# Altium schematic sheet Motor Interface - Pre-Charge HV.SchDoc: Motor Interface - PreCharge HV
size B; Organization: Midnight Sun Solar Rayce Car Team; Address1: University of Waterloo; Address2: 200 University Ave W; Address3: Waterloo, ON, Canada; Address4: N2L 3E9; DocumentNumber: 5; SheetNumber: 5; SheetTotal: 6; Website: www.uwmidsun.com; ProjectName: ProjectName
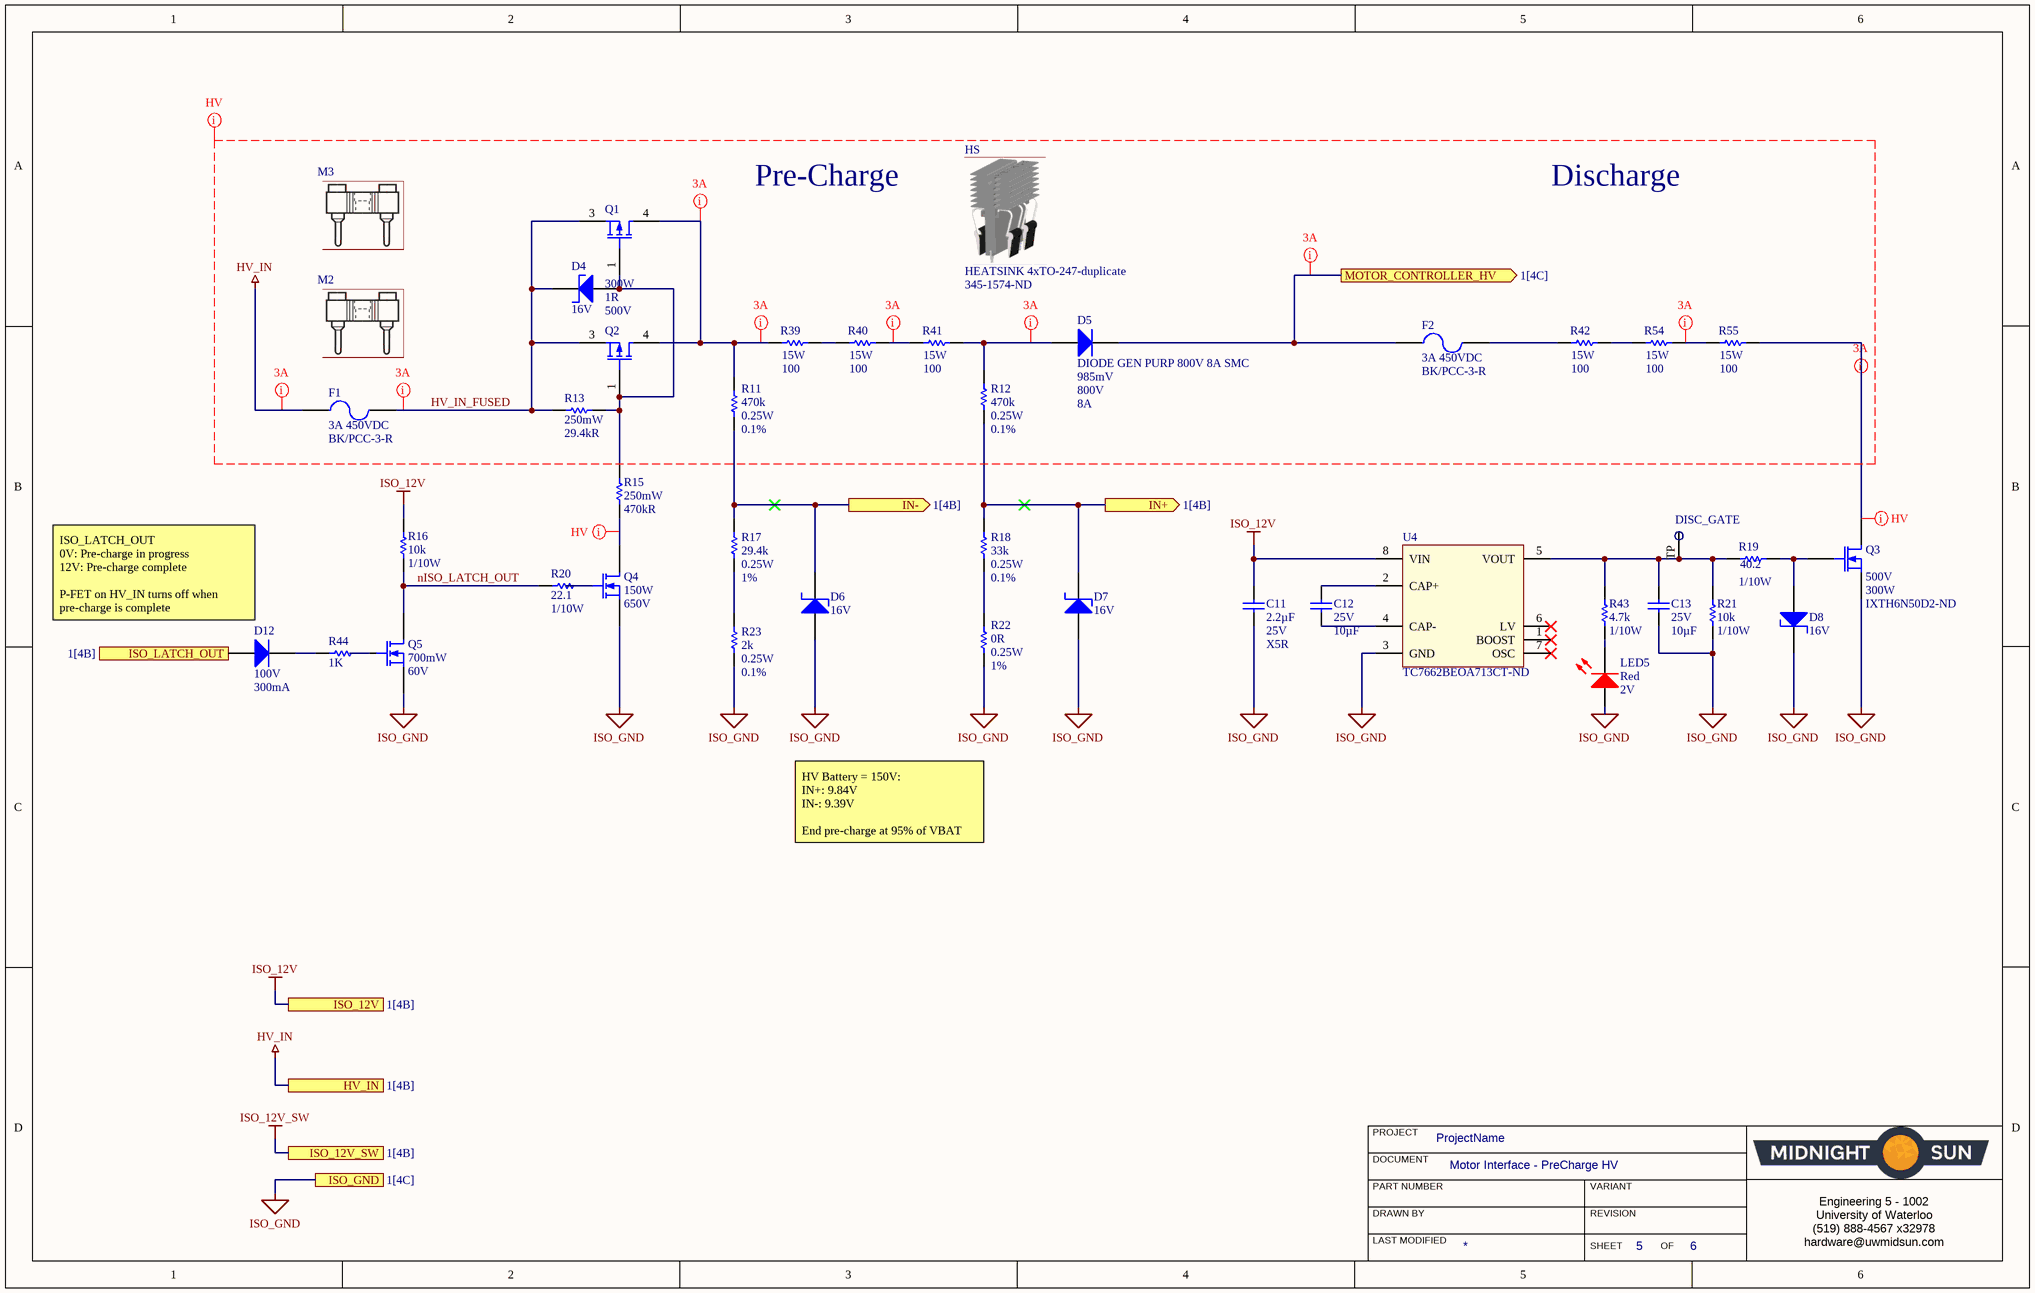
[diagram p0: Motor Interface - Pre-Charge HV.SchDoc]

## Parts
C11  Capacitance: 2.2µF  Voltage: 25V  Temperature Coefficient: X5R  [CAP, 0603]  (hidden comment: CAP CER 2.2UF 25V 10% X5R 0603)
C12  Voltage - Rated: 25V  Capacitance: 10µF  [CAP, 0805]  (hidden comment: CAP CER 10uF 25V 10% X5R 0805)
C13  Voltage - Rated: 25V  Capacitance: 10µF  [CAP, 0805]  (hidden comment: CAP CER 10uF 25V 10% X5R 0805)
D4  Voltage - Zener (Nom): 16V  [DO-214AA Diode]  (hidden comment: DIODE ZENER 16V 5W DO-214AA (SMB))
D5  DIODE GEN PURP 800V 8A SMC  Forward Voltage: 985mV  Max Reverse Voltage (DC): 800V  Forward Current: 8A  [DIODE, SMC]
D6  Voltage - Zener (Nom): 16V  [DO-214AA Diode]  (hidden comment: DIODE ZENER 16V 5W DO-214AA (SMB))
D7  Voltage - Zener (Nom): 16V  [DO-214AA Diode]  (hidden comment: DIODE ZENER 16V 5W DO-214AA (SMB))
D8  Voltage - Zener (Nom): 16V  [DO-214AA Diode]  (hidden comment: DIODE ZENER 16V 5W DO-214AA (SMB))
D12  Max Repetitive Reverse Voltage (Vrrm): 100V  Forward Current: 300mA  [DIODE GEN PURP 100V 300MA SOD123]  (hidden comment: DIODE GEN PURP 100V 300MA SOD123)
DISC_GATE  Test Point  [Test Point]  (value not drawn)  (no BOM)
F1  3A 450VDC  Manufacturer Part Number: BK/PCC-3-R  [FUSE 5A 400VDC RADIAL]
F2  3A 450VDC  Manufacturer Part Number: BK/PCC-3-R  [FUSE 5A 400VDC RADIAL]
HS  HEATSINK 4xTO-247-duplicate  Supplier Part Number 1: 345-1574-ND  [HEATSINK 4x TO-247 - duplicate]
LED5  Color: Red  Voltage - Forward (Vf) (Typ): 2V  [LED_0603]  (hidden comment: LED RED CLEAR 2V 0603)
M2  FUSE HOLDER PC-TRON RADIAL  (value not drawn)  (mechanical)
M3  FUSE HOLDER PC-TRON RADIAL  (value not drawn)  (mechanical)
Q1  Max Power Dissipation: 300W  Rds On Max: 1R  Drain to Source Voltage (Vdss): 500V  [P-CH MOSFET 500V 10A 300W TO-263]  (hidden comment: IXTA10P50P)
Q2  IXTA10P50P  [P-CH MOSFET 500V 10A 300W TO-263]  (value not drawn)
Q3  Drain to Source Voltage (Vdss): 500V  Max Power Dissipation: 300W  Supplier Part Number 1: IXTH6N50D2-ND  [N-CH Depletion Mode TO-247-3]  (hidden comment: MOSFET DEPLETION N-CH 500V 6A TO247)
Q4  Max Power Dissipation: 150W  Drain to Source Voltage (Vdss): 650V  [P-CH MOSFET 500V 10A 300W TO-263]  (hidden comment: MOSFET N-CH 650V 8A X2 TO-263)
Q5  Max Power Dissipation: 700mW  Drain to Source Voltage (Vdss): 60V  [SOT23]  (hidden comment: MOSFET N-CH 60V 310MA SOT23)
R11  Tolerance: 0.1%  Max Power Dissipation: 0.25W  Resistance: 470k  [RES 1206]  (hidden comment: RESISTOR)
R12  Tolerance: 0.1%  Max Power Dissipation: 0.25W  Resistance: 470k  [RES 1206]  (hidden comment: RESISTOR)
R13  Max Power Dissipation: 250mW  Resistance: 29.4kR  [RES 1206]  (hidden comment: Resistor)
R15  Max Power Dissipation: 250mW  Resistance: 470kR  [RES 1206]  (hidden comment: RESISTOR)
R16  Resistance: 10k  Power: 1/10W  [RES, 0603]  (hidden comment: RES 10K OHM 1% 1/10W 0603)
R17  Tolerance: 1%  Max Power Dissipation: 0.25W  Resistance: 29.4k  [RES 1206]  (hidden comment: Resistor)
R18  Tolerance: 0.1%  Resistance: 33k  Max Power Dissipation: 0.25W  [RES 1206]  (hidden comment: Resistor)
R19  Resistance: 40.2  Power: 1/10W  [RES, 0603]  (hidden comment: RES 40.2 OHM 0.5% 1/10W 0603)
R20  Resistance: 22.1  Power: 1/10W  [RES, 0603]  (hidden comment: RES 22.1 OHM 1% 1/10W 0603)
R21  Resistance: 10k  Power: 1/10W  [RES, 0603]  (hidden comment: RES 10K OHM 1% 1/10W 0603)
R22  Tolerance: 1%  Power Rating: 0.25W  Resistance: 0R  [RES 1206]  (hidden comment: RES SMD 0 OHM JUMPER 1/4W 1206)
R23  Tolerance: 0.1%  Max Power Dissipation: 0.25W  Resistance: 2k  [RES 1206]  (hidden comment: RES SMD 2K OHM 0.1% 1/4W 1206)
R39  RES 100 OHM 15W 1% TO126  [RES TO-126-2]  (value not drawn)
R40  RES 100 OHM 15W 1% TO126  [RES TO-126-2]  (value not drawn)
R41  RES 100 OHM 15W 1% TO126  [RES TO-126-2]  (value not drawn)
R42  RES 100 OHM 15W 1% TO126  [RES TO-126-2]  (value not drawn)
R43  Resistance (Ohms): 4.7k  Power (Watts): 1/10W  [RES, 0603]  (hidden comment: RES 4.7K OHM 1% 1/10W 0603)
R44  1K  [RES, 0603]
R54  RES 100 OHM 15W 1% TO126  [RES TO-126-2]  (value not drawn)
R55  RES 100 OHM 15W 1% TO126  [RES TO-126-2]  (value not drawn)
U4  Supplier Part Number 1: TC7662BEOA713CT-ND  [SOIC8]  (hidden comment: IC REG SWTCHD CAP INV 20MA 8SOIC)

## Ports
HV_IN (see 1[4B]), IN+ (out, see 1[4B]), IN- (out, see 1[4B]), ISO_12V (see 1[4B]), ISO_12V_SW (see 1[4B]), ISO_GND (see 1[4C]), ISO_LATCH_OUT (in, see 1[4B]), MOTOR_CONTROLLER_HV (out, see 1[4C])

## Nets
HV_IN: F1.1 ; port HV_IN
ISO_12V: C11.2 R16.1 U4.8(VIN) ; port ISO_12V
ISO_12V_SW: port ISO_12V_SW
ISO_GND: C11.1 C13.2 D6.1(A) D7.1(A) D8.2(K) LED5.1(A) Q3.3(S) Q4.3(S) Q5.2(S) R21.2 R22.2 R23.2 U4.3(GND) ; port ISO_GND
HV_IN_FUSED: D4.2(K) F1.2 Q1.3(S) Q2.3(S) R13.1
IN+: D7.2(K) R12.2 R18.1 ; port IN+
IN-: D6.2(K) R11.2 R17.1 ; port IN-
ISO_LATCH_OUT: D12.1(A) ; port ISO_LATCH_OUT
MOTOR_CONTROLLER_HV: D5.1(K) F2.1 ; port MOTOR_CONTROLLER_HV
nISO_LATCH_OUT: Q5.1(D) R16.2 R20.1
NetC12_1: C12.1 U4.2(CAP+)
NetC12_2: C12.2 U4.4(CAP-)
NetC13_1: C13.1 DISC_GATE.TP R19.1 R21.1 R43.1 U4.5(VOUT)
NetD4_1: D4.1(A) Q1.1(G) Q2.1(G) R13.2 R15.1
NetD5_2: D5.2(A) R12.1 R41.2
NetD8_1: D8.1(A) Q3.1(G) R19.2
NetD12_2: D12.2(K) R44.1
NetF2_2: F2.2 R42.1
NetLED5_2: LED5.2(K) R43.2
NetQ1_4: Q1.4(D) Q2.4(D) R11.1 R39.1
NetQ3_2: Q3.2(D) R55.2
NetQ4_1: Q4.1(G) R20.2
NetQ4_4: Q4.4(D) R15.2
NetQ5_3: Q5.3(G) R44.2
NetR17_2: R17.2 R23.1
NetR18_2: R18.2 R22.1
NetR39_2: R39.2 R40.1
NetR40_2: R40.2 R41.1
NetR42_2: R42.2 R54.1
NetR54_2: R54.2 R55.1

Not connected (* = marked no-connect by the designer): U4 1(BOOST)* 6(LV)* 7(OSC)*

## Layout directives
net class HV: HV_IN, HV_IN_FUSED, NetQ3_2, NetQ4_4
mark named 3A: HV_IN, HV_IN_FUSED, MOTOR_CONTROLLER_HV, NetD5_2, NetQ1_4, NetQ3_2, NetR40_2, NetR54_2

## Notes on the sheet
- (near HS) Pre-Charge
- Discharge
- (near D12) ISO_LATCH_OUT
  0V: Pre-charge in progress
  12V: Pre-charge complete
  P-FET on HV_IN turns off when pre-charge is complete
- HV Battery = 150V:
  IN+: 9.84V
  IN-: 9.39V
  End pre-charge at 95% of VBAT
- PROJECT
- DOCUMENT
- DRAWN BY
- LAST MODIFIED
- PART NUMBER
- REVISION
- SHEET
- VARIANT
- OF
- Engineering 5 - 1002
  University of Waterloo
  (519) 888-4567 x32978
  hardware@uwmidsun.com
- (in symbol RES 100 OHM 15W 1% TO126) 100

## Library data of the parts
C11 = CAP CER 2.2UF 25V 10% X5R 0603: 2.2µF ±10% 25V Ceramic Capacitor X5R 0603 (1608 Metric); Manufacturer 1: Murata Electronics North America; Manufacturer Part Number 1: GRM188R61E225KA12D; Supplier 1: Digi-Key; Supplier Part Number 1: 490-10731-1-ND; Packaging: Cut Tape (CT); Part Status: Active; Operating Temperature: -55°C ~ 85°C; Ratings: -; Mounting Type: Surface Mount, MLCC; Package / Case: 0603 (1608 Metric); Size / Dimension: 0.063" L x 0.031" W (1.60mm x 0.80mm); Height - Seated (Max): -; Thickness (Max): 0.035" (0.90mm); Lead Spacing: -; Lead Style: -; ComponentLink1URL: http://www.murata.com/~/media/webrenewal/support/library/catalog/products/capacitor/mlcc/c02e.ashx; ComponentLink1Description: http://www.murata.com/~/media/webrenewal/support/library/catalog/products/capacitor/mlcc/c02e.ashx; Tolerance: ±10%
C12 C13 = CAP CER 10uF 25V 10% X5R 0805: 10µF ±10% 25V Ceramic Capacitor X5R 0805 (2012 Metric); Manufacturer: Murata Electronics North America; Manufacturer Part Number: GRM21BR61E106KA73L; Supplier 1: Digi-Key; RoHS: RoHS Compliant; Category: Capacitors; Stock 1: 1695157; Packaging: Cut Tape (CT); Part Status: Active; Tolerance: ±10%; Temperature Coefficient: X5R; Operating Temperature: -55°C ~ 85°C; Features: -; Ratings: -; Applications: General Purpose; Mounting Type: Surface Mount, MLCC; Package / Case: 0805 (2012 Metric); Size / Dimension: 0.079" L x 0.049" W (2.00mm x 1.25mm); Height - Seated (Max): -; Thickness (Max): 0.053" (1.35mm); Lead Spacing: -; Lead Style: -; ComponentLink1URL: http://search.murata.co.jp/Ceramy/image/img/A01X/G101/ENG/GRM21BR61E106KA73-01.pdf; ComponentLink1Description: http://search.murata.co.jp/Ceramy/image/img/A01X/G101/ENG/GRM21BR61E106KA73-01.pdf; Supplier Part Number 1: 490-5523-1-ND; Pricing 1: 1=0.3, 10=0.214, 100=0.1008, 500=0.07068, 1000=0.05851 (CAD)
D4 D6-D8 = DIODE ZENER 16V 5W DO-214AA (SMB): Zener Diode 16V 5W ±5% Surface Mount DO-214AA (SMB); Manufacture: Micro Commercial Co; Manufacture Part Number: SMBJ5353B-TP; Impedence (Max): 2.5 Ohm; Voltage - Forward: 1.2V @ 1A; Power (Max): 5W; Supplier 1: Digi-Key; Supplier Part Number 1: SMBJ5353B-TPMSCT-ND
D5 = DIODE GEN PURP 800V 8A SMC: Manufacturer: Diodes; Manufacturer Part Number: S8KC-13; Peak Reverse Current: 10uA; Max Surge Current: 200A; Element Configuration: Single; Supplier 1: Digi-Key; Stock 1: 38298; Pricing 1: 1=0.68, 10=0.598, 100=0.4586, 500=0.36256, 1000=0.29005 (USD); Mount: Surface Mount; Case/Package: SMC; Number of Pins: 2; Weight: 0.007408oz; Contact Plating: Tin,Matte; Min Operating Temperature: -65°C; Max Operating Temperature: 150°C; Packaging: Tape and Reel; Package Quantity: 3000; Reverse Voltage (DC): 800V; Average Rectified Current: 8A; Max Repetitive Reverse Voltage (Vrrm): 800V; Peak Non-Repetitive Surge Current: 200A; Max Forward Surge Current (Ifsm): 200A; Length: 7.11mm; Height: 2.42mm; Width: 6.22mm; Radiation Hardening: No; Lead Free: Lead Free; ComponentLink1URL: https://datasheet.ciiva.com/15144/getdatasheetpartid-61102-15144323.pdf; ComponentLink1Description: https://datasheet.ciiva.com/15144/getdatasheetpartid-61102-15144323.pdf; ComponentLink2URL: https://datasheet.ciiva.com/16388/ds31117-16388346.pdf; ComponentLink2Description: https://datasheet.ciiva.com/16388/ds31117-16388346.pdf; ComponentLink3URL: https://datasheet.ciiva.com/914/ds31117-914779.pdf; ComponentLink3Description: https://datasheet.ciiva.com/914/ds31117-914779.pdf; ComponentLink4URL: https://datasheet.ciiva.com/4453/ds31117-63855-4453947.pdf; ComponentLink4Description: https://datasheet.ciiva.com/4453/ds31117-63855-4453947.pdf; Supplier Part Number 1: S8KCDICT-ND
D12 = DIODE GEN PURP 100V 300MA SOD123: Diode Standard 100V 300mA (DC) Surface Mount SOD-123; Manufacturer: Diodes Zetex; Manufacturer Part Number: 1N4148WQ-7-F; Max Surge Current: 2A; Forward Voltage: 1.25V; Element Configuration: Single; Recovery Time: 4ns; Peak Reverse Current: 50uA; Max Power Dissipation: 400mW; Supplier 1: Digi-Key; Stock 1: 229; Pricing 1: 1=0.22, 10=0.196, 100=0.107, 500=0.0658, 1000=0.0449 (USD); Mount: Surface Mount; Case/Package: SOD-123-2; Number of Pins: 2; Weight: 0.000353oz; Contact Plating: Tin,Matte; Min Operating Temperature: -65°C; Max Operating Temperature: 150°C; Packaging: Tape and Reel; Peak Non-Repetitive Surge Current: 2A; Package Quantity: 3000; Reverse Recovery Time: 4ns; Lead Free: Lead Free; ComponentLink1URL: http://components.arrow.com/part/dataview/0323_07206809; ComponentLink1Description: http://components.arrow.com/part/dataview/0323_07206809; ComponentLink2URL: http://www.diodes.com/datasheets/ds30086.pdf; ComponentLink2Description: http://www.diodes.com/datasheets/ds30086.pdf; ComponentLink3URL: http://www.mouser.com/ds/2/115/ds30086-318161.pdf; ComponentLink3Description: http://www.mouser.com/ds/2/115/ds30086-318161.pdf; Supplier Part Number 1: 1N4148WQ-7-FDICT-ND
F1 F2 = FUSE 3A 250VAC/450VDC RADIAL: FUSE BOARD MNT 3A 250VAC/450VDC; Manufacturer: Eaton; Approvals: CSA,UL; Fuse Type: Board Mount (Cartridge Style Excluded); Voltage Rating: 250V; Voltage Rating (DC): 450V; Supplier 1: Digi-Key; ComponentLink1Description: http://www.cooperindustries.com/content/dam/public/bussmann/Electronics/Resources/product-datasheets/Bus_Elx_DS_2034_PC_Tron_Series.pdf; ComponentLink1URL: http://www.cooperindustries.com/content/dam/public/bussmann/Electronics/Resources/product-datasheets/Bus_Elx_DS_2034_PC_Tron_Series.pdf; Supplier Part Number 1: 283-2768-ND; Case/Package: Radial; Contact Plating: Tin; Current Rating: 3A; Depth: 2.41mm; Height: 0.17inch; Housing Material: Plastic; Length: 0.3inch; Mount: Through Hole; Number of Pins: 2; Packaging: Bulk; Voltage Rating (AC): 250V; Width: 0.095inch; Supplier Packaging 1: Bulk; RoHS: Yes; Stock 1: 4171
HS = HEATSINK 4xTO-247-duplicate: n Heat Sink TO-220, TO-247, TO-264 Aluminum Board Level, Vertical; Manufacturer: Wakefield; Manufacturer Part Number: OMNI-UNI-30-50-D; Supplier 1: Digi-Key; Stock 1: 465; Pricing 1: 1=4.09, 10=3.98, 25=3.8724, 50=3.6572, 100=3.4421, 250=3.22696, 500=3.11938, 1000=2.79669 (USD)
LED5 = LED RED CLEAR 2V 0603: Red 631nm LED Indication - Discrete 2V 0603 (1608 Metric); Manufacturer: Wurth Electronics Inc.; Manufacturer Part Number: 150060RS75000; Lens Color: Colorless; Millicandela Rating: 250mcd; Lens Style/Size: Rectangle with Flat Top, 1.10mm x 0.70mm; Current - Test: 20mA; Viewing Angle: 140°; Wavelength - Dominant: 625nm; Wavelength - Peak: 630nm; Supplier 1: Digi-Key; RoHS: RoHS Compliant; Category: Optoelectronics; Stock 1: 35521; Pricing 1: 1=0.21, 100=0.1617, 500=0.13964 (CAD); Packaging: Cut Tape (CT); Part Status: Active; Lens Transparency: Clear; Mounting Type: Surface Mount; Features: -; Package / Case: 0603 (1608 Metric); Supplier Device Package: 0603; Size / Dimension: 1.60mm L x 0.80mm W; Height (Max): 0.80mm; ComponentLink1URL: http://katalog.we-online.de/led/datasheet/150060RS75000.pdf; ComponentLink1Description: http://katalog.we-online.de/led/datasheet/150060RS75000.pdf; Supplier Part Number 1: 732-4978-1-ND
M2 M3 = FUSE HOLDER PC-TRON RADIAL: Fuse Holder 1 Circuit Radial PCB; Manufacturer: Eaton; Manufacturer Part Number: BK/PCS; Number of Circuits: 1; Case/Package: Radial; Mount: PCB; Orientation: Vertical; Pricing 1: 1 = 1.54000, 5 = 1.49400, 10 = 1.39800, 50 = 1.15680, 100 = 0.96400, 250 = 0.93992, 500 = 0.79530, 1000 = 0.69890, 5000 = 0.62660 (USD); RoHS: Yes; Stock 1: 7906; Supplier 1: Digi-Key; Supplier Part Number 1: 283-2356-ND; Termination: PC Pin
Q1 = MOSFET P-CH 500V 10A 300W TO-263: P-Channel 500V 10A (Tc) 300W (Tc) Surface Mount TO-263 (IXTA); Manufacturer: IXYS; Input Capacitance: 2.84nF; Rise Time: 28ns; Fall Time: 44ns; Turn-Off Delay Time: 52ns; Number of Elements: 1; Element Configuration: Single; Drain to Source Breakdown Voltage: -500V; Gate to Source Voltage (Vgs): 20V; Supplier 1: Digi-Key; Manufacturer Part Number: IXTA10P50P; Stock 1: 2142; Pricing 1: 1=5.96, 10=5.319, 100=4.3614, 500=3.53166, 1000=2.9785 (USD); Mount: Surface Mount; Case/Package: TO-263; Min Operating Temperature: -55°C; Max Operating Temperature: 150°C; Package Quantity: 50; Packaging: Rail/Tube; Continuous Drain Current (ID): 10A; Drain to Source Resistance: 1R; Power Dissipation: 300W; On-State Resistance: 1R; Radiation Hardening: No; Lead Free: Lead Free; ComponentLink1URL: https://datasheet.ciiva.com/15203/getdatasheetpartid-371166-15203275.pdf; ComponentLink1Description: https://datasheet.ciiva.com/15203/getdatasheetpartid-371166-15203275.pdf; Supplier Part Number 1: IXTA10P50P-ND
Q2 = MOSFET P-CH 500V 10A 300W TO-263: P-Channel 500V 10A (Tc) 300W (Tc) Surface Mount TO-263 (IXTA); Manufacturer: IXYS; Input Capacitance: 2.84nF; Rise Time: 28ns; Fall Time: 44ns; Drain to Source Resistance: 1R; Turn-Off Delay Time: 52ns; Number of Elements: 1; Element Configuration: Single; Drain to Source Breakdown Voltage: -500V; Gate to Source Voltage (Vgs): 20V; Supplier 1: Digi-Key; Manufacturer Part Number: IXTA10P50P; Stock 1: 2142; Pricing 1: 1=5.96, 10=5.319, 100=4.3614, 500=3.53166, 1000=2.9785 (USD); Mount: Surface Mount; Case/Package: TO-263; Min Operating Temperature: -55°C; Max Operating Temperature: 150°C; Package Quantity: 50; Packaging: Rail/Tube; Continuous Drain Current (ID): 10A; Power Dissipation: 300W; On-State Resistance: 1R; Radiation Hardening: No; Lead Free: Lead Free; ComponentLink1URL: https://datasheet.ciiva.com/15203/getdatasheetpartid-371166-15203275.pdf; ComponentLink1Description: https://datasheet.ciiva.com/15203/getdatasheetpartid-371166-15203275.pdf; Supplier Part Number 1: IXTA10P50P-ND
Q3 = MOSFET DEPLETION N-CH 500V 6A TO247: N-Channel 500V 6A (Tc) 300W (Tc) Through Hole TO-247 (IXTH); Manufacturer: IXYS; Manufacturer Part Number: IXTH6N50D2; Rds On Max: 500mR; Input Capacitance: 2.8nF; Stock 1: 79; Pricing 1: 1=7.25, 10=6.521, 100=5.3613, 500=4.4919, 1000=3.9123 (USD); Mount: Through Hole; Case/Package: TO-247-3; Packaging: Rail/Tube; Package Quantity: 30; Continuous Drain Current (ID): 6A; ComponentLink1URL: https://datasheet.ciiva.com/949/ds100177bixta-tp-th6n50d2-949628.pdf; ComponentLink1Description: https://datasheet.ciiva.com/949/ds100177bixta-tp-th6n50d2-949628.pdf; ComponentLink2URL: https://datasheet.ciiva.com/26790/ixth6n50d2-26790808.pdf; ComponentLink2Description: https://datasheet.ciiva.com/26790/ixth6n50d2-26790808.pdf; Supplier 1: Digi-Key
Q4 = MOSFET N-CH 650V 8A X2 TO-263: N-Channel 650V 8A (Tc) 150W (Tc) Surface Mount TO-263; Manufacturer: IXYS; Manufacturer Part Number: IXTA8N65X2; Rds On Max: 500mR; Input Capacitance: 800pF; Supplier 1: Digi-Key; Stock 1: 69; Pricing 1: 1=2.85, 10=2.576, 100=2.07, 500=1.61, 1000=1.334 (USD); Mount: Surface Mount; Case/Package: TO-263-3; Min Operating Temperature: -55°C; Max Operating Temperature: 150°C; Packaging: Rail/Tube; Continuous Drain Current (ID): 8A; ComponentLink1URL: http://www.mouser.com/ds/2/205/DS100649B(IXTY-TA-TP8N65X2)-1132259.pdf; ComponentLink1Description: http://www.mouser.com/ds/2/205/DS100649B(IXTY-TA-TP8N65X2)-1132259.pdf; ComponentLink2URL: http://ixapps.ixys.com/DataSheet/DS100649B(IXTY-TA-TP8N65X2).pdf; ComponentLink2Description: http://ixapps.ixys.com/DataSheet/DS100649B(IXTY-TA-TP8N65X2).pdf; Supplier Part Number 1: IXTA8N65X2-ND
Q5 = MOSFET N-CH 60V 310MA SOT23: N-Channel 60V 310mA (Ta) 370mW (Ta) Surface Mount SOT-23; Manufacturer: Diodes; Manufacturer Part Number: DMN6140L-7; Rds On Max: 140mR; Input Capacitance: 315pF; Continuous Drain Current (ID): 1.6A; Threshold Voltage: 3V; Element Configuration: Single; Number of Channels: 1; Gate to Source Voltage (Vgs): 20V; Fall Time: 2.7ns; Rise Time: 3.6ns; Turn-Off Delay Time: 16.3ns; Turn-On Delay Time: 2.6ns; Power Dissipation: 540mW; FET Type: 1 N-Channel; Supplier 1: Digi-Key; Stock 1: 0; Mount: Surface Mount; Case/Package: TO-236-3; Number of Pins: 3; Weight: 0.000282oz; Min Operating Temperature: -55°C; Max Operating Temperature: 150°C; Package Quantity: 3000; Packaging: Tape and Reel; Drain to Source Resistance: 140mR; REACH SVHC: No SVHC; Lead Free: Lead Free; ComponentLink1URL: https://datasheet.ciiva.com/29747/dmn6140l-29747654.pdf; ComponentLink1Description: https://datasheet.ciiva.com/29747/dmn6140l-29747654.pdf; ComponentLink2URL: https://datasheet.ciiva.com/29747/dmn6140l-29747660.pdf; ComponentLink2Description: https://datasheet.ciiva.com/29747/dmn6140l-29747660.pdf; Supplier Part Number 1: DMN65D8L-7DICT-ND; Drain to Source Breakdown Voltage: 60V; Number of Elements: 1; Length: 3mm; Height: 1.1mm; Width: 1.4mm; ComponentLink3URL: https://datasheet.ciiva.com/6371/dmn65d8l-6371124.pdf; ComponentLink3Description: https://datasheet.ciiva.com/6371/dmn65d8l-6371124.pdf; ComponentLink4URL: https://datasheet.ciiva.com/6371/dmn65d8l-6371126.pdf; ComponentLink4Description: https://datasheet.ciiva.com/6371/dmn65d8l-6371126.pdf; ComponentLink5URL: https://datasheet.ciiva.com/13058/dmn65d8l-219098-13058455.pdf; ComponentLink5Description: https://datasheet.ciiva.com/13058/dmn65d8l-219098-13058455.pdf; ComponentLink6URL: https://datasheet.ciiva.com/6371/dmn65d8l-6371128.pdf; ComponentLink6Description: https://datasheet.ciiva.com/6371/dmn65d8l-6371128.pdf
R11 R12 R15 = RES SMD 470K OHM 0.1% 1/4W 1206: 470 kOhms ±0.1% 0.25W, 1/4W Chip Resistor 1206 (3216 Metric) Anti-Sulfur, Automotive AEC-Q200 Thin Film; Manufacturer: Susumu; Manufacturer Part Number: RG3216P-4703-B-T1; Power Rating: 125mW; Voltage Rating: 150V; Temperature Coefficient: 25ppm/°C; Voltage Rating (DC): 200V; Supplier 1: Digi-Key; Stock 1: 2986; Pricing 1: 1=0.66, 10=0.474, 100=0.2462 (USD); Case/Package: 1206; Number of Pins: 2; Case Code (Metric): 3216; Case Code (Imperial): 1206; Min Operating Temperature: -55°C; Max Operating Temperature: 155°C; Packaging: Tape and Reel; Package Quantity: 1; Composition: Thin Film; Number of Terminations: 2; Termination: SMD/SMT; Length: 0.126inch; Height: 0.02inch; Width: 0.063inch; Lead Free: Lead Free; ComponentLink1URL: https://datasheet.ciiva.com/2490/rg-rm-rgh-datasheet-2490488.pdf; ComponentLink1Description: https://datasheet.ciiva.com/2490/rg-rm-rgh-datasheet-2490488.pdf; ComponentLink2URL: https://datasheet.ciiva.com/2490/rg-rm-rgh-datasheet-2490489.pdf; ComponentLink2Description: https://datasheet.ciiva.com/2490/rg-rm-rgh-datasheet-2490489.pdf; ComponentLink3URL: https://datasheet.ciiva.com/2490/rg-rm-rgh-datasheet-2490490.pdf; ComponentLink3Description: https://datasheet.ciiva.com/2490/rg-rm-rgh-datasheet-2490490.pdf; ComponentLink4URL: https://datasheet.ciiva.com/12760/rg-rm-rgh-datasheet-12760397.pdf; ComponentLink4Description: https://datasheet.ciiva.com/12760/rg-rm-rgh-datasheet-12760397.pdf; Supplier Part Number 1: RG32P470KBDKR-ND
  R15: Tolerance: 0.1%
R13 = RES SMD 29.4K OHM 1% 1/4W 1206: 29.4 kOhms ±1% 0.25W, 1/4W Chip Resistor 1206 (3216 Metric) Automotive AEC-Q200 Thick Film; Manufacturer: Panasonic; Manufacturer Part Number: ERJ-8ENF2942V; Voltage Rating: 200V; Temperature Coefficient: 100ppm/°C; Supplier 1: Digi-Key; Stock 1: 24502; Pricing 1: 1=0.11, 10=0.097, 100=0.0373, 1000=0.01641, 2500=0.01417 (USD); Mount: Surface Mount; Case/Package: 1206; Weight: 0.000571oz; Case Code (Metric): 3216; Case Code (Imperial): 1206; Contact Plating: Tin; Min Operating Temperature: -55°C; Max Operating Temperature: 155°C; Packaging: Tape and Reel; Power Rating: 250mW; Tolerance: 1%; Package Quantity: 1; Composition: Thick Film; Number of Terminations: 2; Voltage Rating (DC): 200V; Termination: SMD/SMT; Military Standard: Not; Length: 3.2mm; Height: 0.028inch; Width: 0.063inch; Depth: 1.6mm; REACH SVHC: No SVHC; ComponentLink1URL: https://datasheet.ciiva.com/7861/426256-7861912.pdf; ComponentLink1Description: https://datasheet.ciiva.com/7861/426256-7861912.pdf; ComponentLink2URL: https://datasheet.ciiva.com/24126/aoa0000ce2-24126731.pdf; ComponentLink2Description: https://datasheet.ciiva.com/24126/aoa0000ce2-24126731.pdf; ComponentLink3URL: https://datasheet.ciiva.com/6159/426256-6159628.pdf; ComponentLink3Description: https://datasheet.ciiva.com/6159/426256-6159628.pdf; ComponentLink4URL: https://datasheet.ciiva.com/9191/aoa0000ce2-9191007.pdf; ComponentLink4Description: https://datasheet.ciiva.com/9191/aoa0000ce2-9191007.pdf; Supplier Part Number 1: P29.4KFCT-ND
R16 R21 = RES 10K OHM 1% 1/10W 0603: RES SMD 10K OHM 1% 1/10W 0603; Manufacturer 1: Yageo; Manufacturer Part Number 1: RC0603FR-0710KL; Temperature Coefficient: ±100ppm/°C; Supplier 1: Digi-Key; Supplier Part Number 1: 311-10.0KHRCT-ND; Packaging: Cut Tape (CT); Part Status: Active; Composition: Thick Film; Operating Temperature: -55°C ~ 155°C; Package / Case: 0603 (1608 Metric); Supplier Device Package: 0603; Size / Dimension: 0.063" L x 0.031" W (1.60mm x 0.80mm); Height - Seated (Max): 0.022" (0.55mm); Failure Rate: -; ComponentLink1URL: http://www.yageo.com/documents/recent/PYu-RC_Group_51_RoHS_L_7.pdf; ComponentLink1Description: http://www.yageo.com/documents/recent/PYu-RC_Group_51_RoHS_L_7.pdf; Tolerance: ±1%
R17 = RES SMD 29.4K OHM 1% 1/4W 1206: 29.4 kOhms ±1% 0.25W, 1/4W Chip Resistor 1206 (3216 Metric) Automotive AEC-Q200 Thick Film; Manufacturer: Panasonic; Manufacturer Part Number: ERJ-8ENF2942V; Power Rating: 250mW; Voltage Rating: 200V; Temperature Coefficient: 100ppm/°C; Supplier 1: Digi-Key; Stock 1: 24502; Pricing 1: 1=0.11, 10=0.097, 100=0.0373, 1000=0.01641, 2500=0.01417 (USD); Mount: Surface Mount; Case/Package: 1206; Weight: 0.000571oz; Case Code (Metric): 3216; Case Code (Imperial): 1206; Contact Plating: Tin; Min Operating Temperature: -55°C; Max Operating Temperature: 155°C; Packaging: Tape and Reel; Package Quantity: 1; Composition: Thick Film; Number of Terminations: 2; Voltage Rating (DC): 200V; Termination: SMD/SMT; Military Standard: Not; Length: 3.2mm; Height: 0.028inch; Width: 0.063inch; Depth: 1.6mm; REACH SVHC: No SVHC; ComponentLink1URL: https://datasheet.ciiva.com/7861/426256-7861912.pdf; ComponentLink1Description: https://datasheet.ciiva.com/7861/426256-7861912.pdf; ComponentLink2URL: https://datasheet.ciiva.com/24126/aoa0000ce2-24126731.pdf; ComponentLink2Description: https://datasheet.ciiva.com/24126/aoa0000ce2-24126731.pdf; ComponentLink3URL: https://datasheet.ciiva.com/6159/426256-6159628.pdf; ComponentLink3Description: https://datasheet.ciiva.com/6159/426256-6159628.pdf; ComponentLink4URL: https://datasheet.ciiva.com/9191/aoa0000ce2-9191007.pdf; ComponentLink4Description: https://datasheet.ciiva.com/9191/aoa0000ce2-9191007.pdf; Supplier Part Number 1: P29.4KFCT-ND
R18 = RES SMD 33K OHM 0.1% 1/4W 1206: 33 kOhms ±0.1% 0.25W, 1/4W Chip Resistor 1206 (3216 Metric) Thin Film; Manufacturer: Yageo; Manufacturer Part Number: RT1206BRD0733KL; Voltage Rating: 200V; Power Rating: 250mW; Temperature Coefficient: 25ppm/°C; Supplier 1: Digi-Key; Stock 1: 13446; Pricing 1: 1=0.68, 10=0.523, 100=0.22, 1000=0.12137, 2500=0.11378 (USD); Case/Package: 1206; Case Code (Metric): 3216; Case Code (Imperial): 1206; Contact Plating: Tin,Matte; Min Operating Temperature: -55°C; Max Operating Temperature: 125°C; Packaging: Tape and Reel; Package Quantity: 5000; Termination: SMD/SMT; Composition: Thin Film; Number of Terminations: 2; Military Standard: Not; Voltage Rating (DC): 200V; Length: 0.122inch; Height: 0.026inch; Width: 0.063inch; Depth: 1.6mm; Radiation Hardening: No; Lead Free: Lead Free; ComponentLink1URL: https://datasheet.ciiva.com/2587/pyu-rt-1-to-0-05-rohs-l-4-2587636.pdf; ComponentLink1Description: https://datasheet.ciiva.com/2587/pyu-rt-1-to-0-05-rohs-l-4-2587636.pdf; ComponentLink2URL: https://datasheet.ciiva.com/46634/pyu-rt-1-to-0-05-rohs-l-5-46634965.pdf; ComponentLink2Description: https://datasheet.ciiva.com/46634/pyu-rt-1-to-0-05-rohs-l-5-46634965.pdf; Supplier Part Number 1: YAG2038CT-ND
R19 = RES 40.2 OHM 0.5% 1/10W 0603: RES SMD 40.2 OHM 0.5% 1/10W 0603; Manufacturer 1: Yageo; Manufacturer Part Number 1: RT0603DRE0740R2L; Temperature Coefficient: ±50ppm/°C; Supplier 1: Digi-Key; Supplier Part Number 1: 311-2576-1-ND; Packaging: Cut Tape (CT); Part Status: Active; Composition: Thin Film; Operating Temperature: -55°C ~ 155°C; Package / Case: 0603 (1608 Metric); Supplier Device Package: 0603; Size / Dimension: 0.063" L x 0.031" W (1.60mm x 0.80mm); Height - Seated (Max): 0.022" (0.55mm); Failure Rate: -; ComponentLink1URL: http://www.yageo.com/documents/recent/PYu-RT_1-to-0.01_RoHS_L_7.pdf; ComponentLink1Description: http://www.yageo.com/documents/recent/PYu-RT_1-to-0.01_RoHS_L_7.pdf; Tolerance: ±0.5%
R20 = RES 22.1 OHM 1% 1/10W 0603: 22.1 Ohm ±1% 0.1W, 1/10W Chip Resistor 0603 (1608 Metric) Moisture Resistant Thick Film; Manufacturer 1: Yageo; Manufacturer Part Number 1: RC0603FR-0722R1L; Temperature Coefficient: ±100ppm/°C; Supplier 1: Digi-Key; Supplier Part Number 1: 311-22.1HRCT-ND; Packaging: Cut Tape (CT); Part Status: Active; Composition: Thick Film; Operating Temperature: -55°C ~ 155°C; Package / Case: 0603 (1608 Metric); Supplier Device Package: 0603; Size / Dimension: 0.063" L x 0.031" W (1.60mm x 0.80mm); Height - Seated (Max): 0.022" (0.55mm); Failure Rate: -; ComponentLink1URL: http://www.yageo.com/documents/recent/PYu-RC_Group_51_RoHS_L_7.pdf; ComponentLink1Description: http://www.yageo.com/documents/recent/PYu-RC_Group_51_RoHS_L_7.pdf; Tolerance: ±1%
R22 = RES SMD 0 OHM JUMPER 1/4W 1206: 0 Ohms Jumper 0.25W, 1/4W Chip Resistor 1206 (3216 Metric) Automotive AEC-Q200 Thick Film; Manufacturer: Vishay; Manufacturer Part Number: CRCW12060000Z0EA; Voltage Rating: 200V; Temperature Coefficient: 100ppm/°C; Supplier 1: Digi-Key; Stock 1: 0; Pricing 1: 1=0.1, 10=0.064, 25=0.046, 50=0.0352, 100=0.0259, 250=0.01976, 500=0.0158, 1000=0.01163 (USD); Mount: Surface Mount; Case/Package: 1206; Weight: 0.000353oz; Case Code (Imperial): 1206; Case Code (Metric): 3216; Contact Plating: Tin; Min Operating Temperature: -55°C; Max Operating Temperature: 155°C; Composition: Thick Film; Packaging: Tape and Reel; Package Quantity: 5000; Military Standard: Not; Termination: SMD/SMT; Voltage Rating (DC): 200V; Length: 3.2mm; Height: 0.55mm; Width: 1.6mm; Depth: 1.6mm; Radiation Hardening: No; REACH SVHC: Unknown; Lead Free: Lead Free; ComponentLink1URL: https://datasheet.ciiva.com/16720/70201119-16720117.pdf; ComponentLink1Description: https://datasheet.ciiva.com/16720/70201119-16720117.pdf; ComponentLink2URL: https://datasheet.ciiva.com/7841/1720486-7841862.pdf; ComponentLink2Description: https://datasheet.ciiva.com/7841/1720486-7841862.pdf; ComponentLink3URL: https://datasheet.ciiva.com/16364/dcrcwe3-16364998.pdf; ComponentLink3Description: https://datasheet.ciiva.com/16364/dcrcwe3-16364998.pdf; ComponentLink4URL: https://datasheet.ciiva.com/5549/dcrcwe3-109170-5549528.pdf; ComponentLink4Description: https://datasheet.ciiva.com/5549/dcrcwe3-109170-5549528.pdf; ComponentLink5URL: https://datasheet.ciiva.com/7841/1697337-7841706.pdf; ComponentLink5Description: https://datasheet.ciiva.com/7841/1697337-7841706.pdf; ComponentLink6URL: https://datasheet.ciiva.com/11809/0900766b80d98b5e-11809211.pdf; ComponentLink6Description: https://datasheet.ciiva.com/11809/0900766b80d98b5e-11809211.pdf; ComponentLink7URL: https://datasheet.ciiva.com/16782/70201119-16782555.pdf; ComponentLink7Description: https://datasheet.ciiva.com/16782/70201119-16782555.pdf; Supplier Part Number 1: 541-0.0ECT-ND
R23 = RES SMD 2K OHM 0.1% 1/4W 1206: 2 kOhms ±0.1% 0.25W, 1/4W Chip Resistor 1206 (3216 Metric) Automotive AEC-Q200 Thin Film; Manufacturer: Panasonic; Manufacturer Part Number: ERA-8AEB202V; Power Rating: 250mW; Voltage Rating: 150V; Temperature Coefficient: 25ppm/°C; Supplier 1: Digi-Key; Stock 1: 43293; Pricing 1: 1=0.66, 10=0.474, 100=0.2465, 1000=0.13276, 2500=0.13095 (USD); Mount: Surface Mount; Case/Package: 1206; Number of Pins: 2; Weight: 0.000571oz; Case Code (Metric): 3216; Case Code (Imperial): 1206; Contact Plating: Tin; Min Operating Temperature: -55°C; Max Operating Temperature: 155°C; Packaging: Tape and Reel; Package Quantity: 5000; Composition: Metal Film,Thin Film; Number of Terminations: 2; Termination: SMD/SMT; Military Standard: Not; Voltage Rating (DC): 150V; Length: 3.2mm; Height: 0.6mm; Width: 0.063inch; Depth: 1.6mm; Radiation Hardening: No; REACH SVHC: No SVHC; Lead Free: Lead Free; ComponentLink1URL: https://datasheet.ciiva.com/43458/391390-43458070.pdf; ComponentLink1Description: https://datasheet.ciiva.com/43458/391390-43458070.pdf; ComponentLink2URL: https://datasheet.ciiva.com/48529/era-eng-tds-48529591.pdf; ComponentLink2Description: https://datasheet.ciiva.com/48529/era-eng-tds-48529591.pdf; ComponentLink3URL: https://datasheet.ciiva.com/6082/391390-6082060.pdf; ComponentLink3Description: https://datasheet.ciiva.com/6082/391390-6082060.pdf; ComponentLink4URL: https://datasheet.ciiva.com/17214/aoa0000ce26-17214381.pdf; ComponentLink4Description: https://datasheet.ciiva.com/17214/aoa0000ce26-17214381.pdf; ComponentLink5URL: https://datasheet.ciiva.com/9197/aoa0000ce26-9197582.pdf; ComponentLink5Description: https://datasheet.ciiva.com/9197/aoa0000ce26-9197582.pdf; Supplier Part Number 1: P2.0KBCCT-ND
R39-R42 R54 R55 = RES 100 OHM 15W 1% TO126: 100 Ohms ±1% 15W Through Hole Resistor TO-126-2 Moisture Resistant, Non-Inductive Thick Film; Manufacturer 1: Caddock; Manufacturer Part Number 1: MP915-100-1%; Voltage Rating: 200V; Resistance: 100R; Temperature Coefficient: 80ppm/°C; Lead Length: 11.4mm; Lead Diameter: 0.64mm; Supplier 1: Digi-Key; Stock 1: 1137; Pricing 1: 1=3.92000, 10=3.50000, 100=2.59000, 1000=1.90400 (USD); RoHS: Yes; Case/Package: TO-126; Min Operating Temperature: -55°C; Max Operating Temperature: 150°C; Max Power Dissipation: 15W; Composition: Thick Film; Tolerance: 1%; Power Rating: 15W; Package Quantity: 50; Packaging: Rail/Tube; Voltage Rating (DC): 200V; Number of Terminations: 2; Termination: Radial; Features: Moisture Resistant; Length: 8.12mm; Height: 0.45inch; Lead Pitch: 5.08mm; Width: 0.11inch; Depth: 2.79mm; Thickness: 0.01inch; REACH SVHC: No SVHC; Lead Free: Lead Free; ComponentLink1URL: https://datasheet.ciiva.com/2720/mp9000-series-2720177.pdf?src-supplier=Digi-Key; ComponentLink1Description: https://datasheet.ciiva.com/2720/mp9000-series-2720177.pdf?src-supplier=Digi-Key; ComponentLink2URL: https://datasheet.ciiva.com/23759/638160-23759638.pdf?src-supplier=Newark; ComponentLink2Description: https://datasheet.ciiva.com/23759/638160-23759638.pdf?src-supplier=Newark; ComponentLink3URL: https://datasheet.ciiva.com/7985/638160-7985902.pdf?src-supplier=Element14; ComponentLink3Description: https://datasheet.ciiva.com/7985/638160-7985902.pdf?src-supplier=Element14; ComponentLink4URL: https://datasheet.ciiva.com/48502/mp900-series-eng-tds-48502127.pdf?src-supplier=Distrelec; ComponentLink4Description: https://datasheet.ciiva.com/48502/mp900-series-eng-tds-48502127.pdf?src-supplier=Distrelec; ComponentLink5URL: https://datasheet.ciiva.com/16724/70089379-16724727.pdf?src-supplier=Allied+Electronics; ComponentLink5Description: https://datasheet.ciiva.com/16724/70089379-16724727.pdf?src-supplier=Allied+Electronics
R43 = RES 4.7K OHM 1% 1/10W 0603: 4.7k Ohm ±1% 0.1W, 1/10W Chip Resistor 0603 (1608 Metric) Moisture Resistant Thick Film; Manufacturer 1: Yageo; Manufacturer Part Number 1: RC0603FR-074K7L; Description 1: RES SMD 4.7K OHM 1% 1/10W 0603; Temperature Coefficient: ±100ppm/°C; Supplier 1: Digi-Key; Supplier Part Number 1: 311-4.70KHRCT-ND; RoHS: RoHS Compliant; Category: Resistors; Stock 1: 3487566; Pricing 1: 1=0.16, 10=0.022, 100=0.0089, 1000=0.00402, 2500=0.00349 (CAD); Packaging: Cut Tape (CT); Part Status: Active; Composition: Thick Film; Features: Moisture Resistant; Operating Temperature: -55°C ~ 155°C; Package / Case: 0603 (1608 Metric); Supplier Device Package: 0603; Size / Dimension: 0.063" L x 0.031" W (1.60mm x 0.80mm); Height - Seated (Max): 0.022" (0.55mm); Failure Rate: -; ComponentLink1URL: http://www.yageo.com/documents/recent/PYu-RC_Group_51_RoHS_L_7.pdf; ComponentLink1Description: http://www.yageo.com/documents/recent/PYu-RC_Group_51_RoHS_L_7.pdf; Tolerance: ±1%
R44 = RES 1K OHM 5% 1/10W 0603: 1k Ohm ±5% 0.1W, 1/10W Chip Resistor 0603 (1608 Metric); Manufacturer: Yageo; Manufacturer Part Number: RC0603JR-071KL; Temperature Coefficient: ±100ppm/°C; Supplier 1: Digi-Key; Supplier Part Number 1: 311-1.0KGRCT-ND; RoHS: RoHS Compliant; Category: Resistors; Stock 1: 4415240; Pricing 1: 1=0.15, 10=0.017, 100=0.0071, 1000=0.0032, 2500=0.00278 (CAD); Packaging: Cut Tape (CT); Part Status: Active; Resistance (Ohms): 1k; Tolerance: ±5%; Power (Watts): 0.1W, 1/10W; Composition: Thick Film; Features: Moisture Resistant; Operating Temperature: -55°C ~ 155°C; Package / Case: 0603 (1608 Metric); Supplier Device Package: 0603; Size / Dimension: 0.063" L x 0.031" W (1.60mm x 0.80mm); Height - Seated (Max): 0.022" (0.55mm); Failure Rate: -; ComponentLink1URL: http://www.yageo.com/documents/recent/PYu-RC_Group_51_RoHS_L_7.pdf; ComponentLink1Description: http://www.yageo.com/documents/recent/PYu-RC_Group_51_RoHS_L_7.pdf
U4 = IC REG SWTCHD CAP INV 20MA 8SOIC: Charge Pump Switching Regulator IC Positive or Negative Fixed -Vin, 2Vin 1 Output 20mA 8-SOIC (0.154", 3.90mm Width); Manufacturer: Microchip; Manufacturer Part Number: TC7662BEOA713; Number of Outputs: 1; Output Voltage: -15V; Min Supply Voltage: 1.5V; Max Supply Voltage: 15V; Switching Frequency: 35kHz; Synchronous Rectifier: No; Logic Function: Inverting; Output Power: 470mW; Supplier 1: Digi-Key; Stock 1: 59; Pricing 1: 1=2.29, 25=1.9056, 100=1.7304 (USD); Mount: Surface Mount; Case/Package: SOIC; Number of Pins: 8; Weight: 0.006596oz; Min Operating Temperature: -40°C; Max Operating Temperature: 85°C; Package Quantity: 1; Packaging: Tape and Reel; Output Current: 20mA; Max Output Current: 20mA; Max Input Voltage: 15V; Max Output Voltage: -15V; Topology: Charge Pump; Length: 5mm; Height: 1.5mm; Width: 3.99mm; Radiation Hardening: No; Lead Free: Lead Free; ComponentLink1URL: https://datasheet.ciiva.com/2024/21469a-2024368.pdf; ComponentLink1Description: https://datasheet.ciiva.com/2024/21469a-2024368.pdf; ComponentLink2URL: https://datasheet.ciiva.com/2024/filehandler-aspxddocname-en026002-2024369.pdf; ComponentLink2Description: https://datasheet.ciiva.com/2024/filehandler-aspxddocname-en026002-2024369.pdf; ComponentLink3URL: https://datasheet.ciiva.com/16295/filehandler-aspxddocname-en011347-16295442.pdf; ComponentLink3Description: https://datasheet.ciiva.com/16295/filehandler-aspxddocname-en011347-16295442.pdf; ComponentLink4URL: https://datasheet.ciiva.com/3216/cn-21469a-3216331.pdf; ComponentLink4Description: https://datasheet.ciiva.com/3216/cn-21469a-3216331.pdf; ComponentLink5URL: https://datasheet.ciiva.com/18553/filehandler-aspxddocname-en026002-18553038.pdf; ComponentLink5Description: https://datasheet.ciiva.com/18553/filehandler-aspxddocname-en026002-18553038.pdf; ComponentLink6URL: https://datasheet.ciiva.com/4875/21469a-4875151.pdf; ComponentLink6Description: https://datasheet.ciiva.com/4875/21469a-4875151.pdf